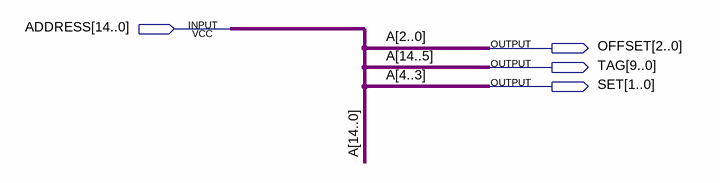
[diagram p0: schematic sheet]
// Quartus schematic Separator.bdf as structural Verilog: 0 symbols, 4 pins
module Separator (
  input  [14:0] ADDRESS,
  output [2:0] OFFSET,
  output [9:0] TAG,
  output [1:0] SET
);


  assign OFFSET = ADDRESS[2:0];
  assign SET = ADDRESS[4:3];
  assign TAG = ADDRESS[14:5];

  // Other names for the same wires on the sheet: A[14:0] = ADDRESS
endmodule
